# EAGLE design ldr (EAGLE 7.6.0)
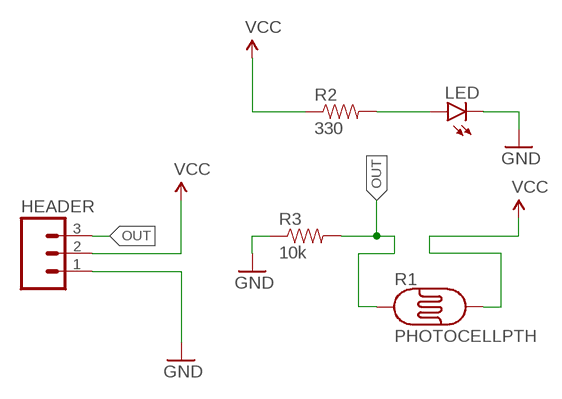
[diagram p0: schematic, sheet 1]

## Parts
HEADER  M03PTH  [1X03]
LED  LED5MM  [LED5MM]
R1  PHOTOCELLPTH  [PHOTOCELL]
R2  330  RESISTOREZ  [AXIAL-0.3EZ]
R3  10k  RESISTOREZ  [AXIAL-0.3EZ]

## Nets
GND: HEADER.1 LED.K(C) R3.P$1
N$1: LED.A R2.P$2
OUT: HEADER.3 R1.1 R3.P$2
VCC: HEADER.2 R1.2 R2.P$1

## Library data of the parts
HEADER = SparkFun-Connectors:M03: Header 3 Standard 3-pin 0.1" header. Use with straight break away headers (SKU : PRT-00116), right angle break away headers (PRT-00553), swiss pins (PRT-00743), machine pins (PRT-00117), and female headers (PRT-00115). Molex polarized connector foot print use with SKU : PRT-08232 with associated crimp pins and housings.
LED = SparkFun-LED:LED: LEDs Standard schematic elements and footprints for 5mm, 3mm, 1206, and 0603 sized LEDs. 5mm - Spark Fun Electronics SKU : COM-00529 (and others)
R1 = SparkFun-Sensors:PHOTOCELL: CdS photoresistor. This is a low cost way to detect light levels. Resistance decreases with more incoming light. SparkFun SKU: SEN-09088
R2 R3 = SparkFun-Resistors:RESISTOR: Resistor Basic schematic elements and footprints for 0603, 1206, and PTH resistors.

## Board
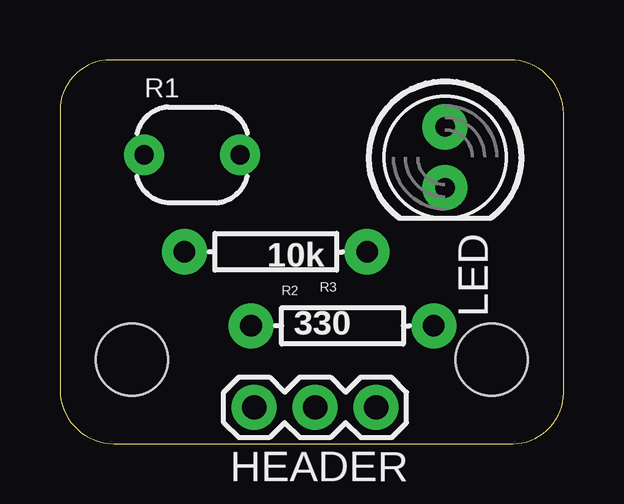
[diagram p1: board, top side]
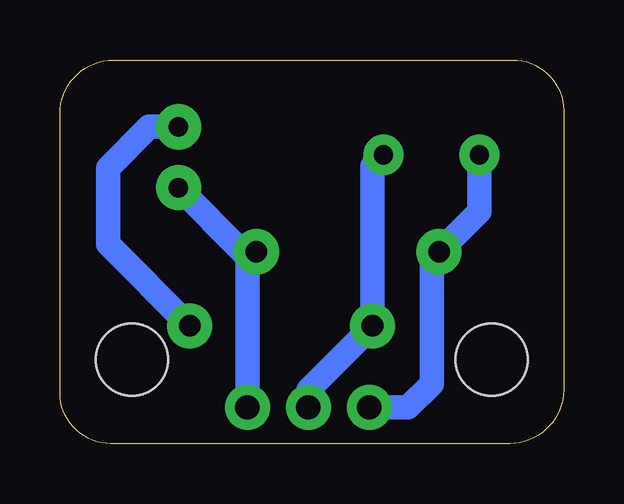
[diagram p2: board, bottom side, seen from below]

Size 21 x 16 mm. Coordinates in mm from the lower left corner, seen from the top.
Outline: 21,2.12 21,13.76 arc90 18.76,16 2.12,16 arc90 0,13.88 0,2.24 arc90 2.24,0 18.88,0 arc90 21,2.12
Copper layers (1*16): Top 0.035mm / dielectric 1.5mm / Bottom 0.035mm
Design rules "default *": minimum track width 10mil, minimum drill 24mil, track to track 8mil, track to pad 8mil, pad to pad 8mil, via to via 8mil, smd to smd 8mil, copper to edge 1mil, drill to drill 8mil, minimum pad ring 10mil, minimum via ring 8mil, stop-mask expansion 4mil, vias tented up to drill 0mil, thermal gap 10mil
Holes 3 mm at 3,3.5 18,3.5

### Footprints (pad centres in the part's own frame; a part is rotated, then mirrored left to right if it is on the bottom)
1X03 = drill 1.016 pad 1.88: 1 0,0; 2 2.54,0; 3 5.08,0
LED5MM = drill 0.813 pad 1.88: A -1.27,0; K 1.27,0
PHOTOCELL = drill 0.8 pad 1.676: 1 -2,0; 2 2,0
AXIAL-0.3EZ = drill 0.9 pad 1.88: P$1 -3.81,0; P$2 3.81,0

### Placement (x,y rotation side)
HEADER  13.18,1.51 180 top
LED  16.06,11.94 270 top
R1  5.51,12.04 0 top
R2  11.78,4.91 0 top
R3  9,8 180 top

### Tracks (layer width: path | path; a pad name or v marks a point on that pad's centre or on a via)
GND
  Bottom 1.016: LED.K 13.39,8 R3.P$1 13.18,7.63 HEADER.1
N$1
  Bottom 1.016: R2.P$2 19,8.32 19,11.5 17.29,13.21 LED.A
OUT
  Bottom 1.016: R1.1 3.51,9.68 R3.P$2 5.5,7.69 5.5,2.5 6.49,1.51 HEADER.3
VCC
  Bottom 1.016: R1.2 7.97,11.58 R2.P$1 10.64,2.24 HEADER.2